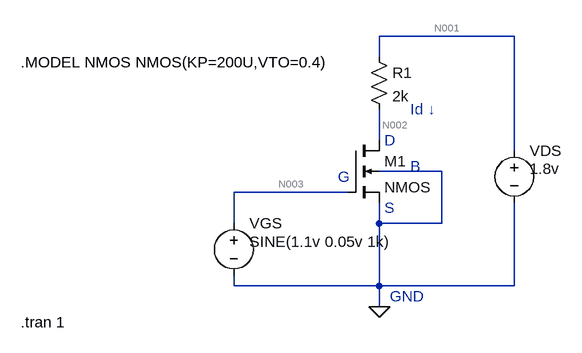
[diagram p0: schematic nmos_vgs_1.1_0.1_1k_vth_0.4_vdh_1.8_cs_amplifier.asc]
nmos_vgs_1.1_0.1_1k_vth_0.4_vdh_1.8_cs_amplifier.asc, the LTspice schematic file:
Version 4
SHEET 1 880 680
WIRE 336 -96 128 -96
WIRE 128 -64 128 -96
WIRE 128 64 128 16
WIRE 336 80 336 -96
WIRE 224 112 128 112
WIRE 80 144 -96 144
WIRE -96 192 -96 144
WIRE 128 192 128 160
WIRE 224 192 224 112
WIRE 224 192 128 192
WIRE -96 288 -96 272
WIRE 128 288 128 192
WIRE 128 288 -96 288
WIRE 336 288 336 160
WIRE 336 288 128 288
WIRE 128 320 128 288
FLAG 128 320 0
SYMBOL nmos4 80 64 R0
SYMATTR InstName M1
SYMATTR Value2 l=1u w=10u
SYMBOL voltage 336 64 R0
WINDOW 3 24 44 Left 2
WINDOW 123 0 0 Left 0
WINDOW 39 0 0 Left 0
SYMATTR Value 1.8v
SYMATTR InstName VDS
SYMBOL voltage -96 176 R0
WINDOW 3 24 44 Left 2
WINDOW 123 0 0 Left 0
WINDOW 39 0 0 Left 0
SYMATTR Value SINE(1.1v 0.05v 1k)
SYMATTR InstName VGS
SYMBOL res 112 -80 R0
SYMATTR InstName R1
SYMATTR Value 2k
TEXT 136 64 Left 2 ;D
TEXT 64 120 Left 2 ;G
TEXT 136 168 Left 2 ;S
TEXT 176 104 Left 2 ;B
TEXT 144 304 Left 2 ;GND
TEXT 176 16 Left 2 ;Id ↓
TEXT -424 -56 Left 2 !.MODEL NMOS NMOS(KP=200U,VTO=0.4)
TEXT -424 344 Left 2 !.tran 1

The netlist it stands for:
* nmos_vgs_1.1_0.1_1k_vth_0.4_vdh_1.8_cs_amplifier.asc
M1 N002 N003 0 0 NMOS l=1u w=10u
VDS N001 0 1.8v
VGS N003 0 SINE(1.1v 0.05v 1k)
R1 N001 N002 2k
.model NMOS NMOS
.model PMOS PMOS
.lib standard.mos
* D
* G
* S
* B
* GND
* Id ↓
.MODEL NMOS NMOS(KP=200U,VTO=0.4)
.tran 1
.backanno
.end

* Results of the author's LTspice run, read from the files saved beside the schematic
* Operating Point, zero values left out:
*   V(n002) = 820 mV
*   V(n003) = 1.1 V
*   V(n001) = 1.8 V
*   Id(M1) = 490 µA
*   Is(M1) = -490 µA
*   I(R1) = 490 µA
*   I(Vds) = -490 µA
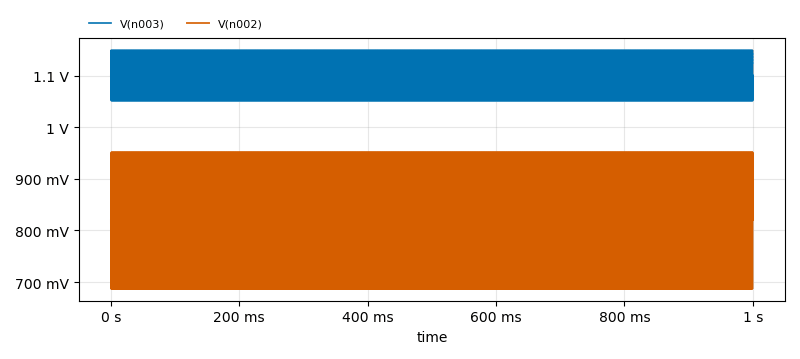
[diagram p1: Transient Analysis of nmos_vgs_1.1_0.1_1k_vth_0.4_vdh_1.8_cs_amplifier.asc, plotted from the saved traces]
* Transient Analysis, 1 run:
*   V(n003): min 1.05 V, max 1.15 V, average 1.1 V, rms 1.101 V, last 1.1 V
*   V(n002): min 684.1 mV, max 954 mV, average 818.7 mV, rms 824.4 mV, last 820 mV